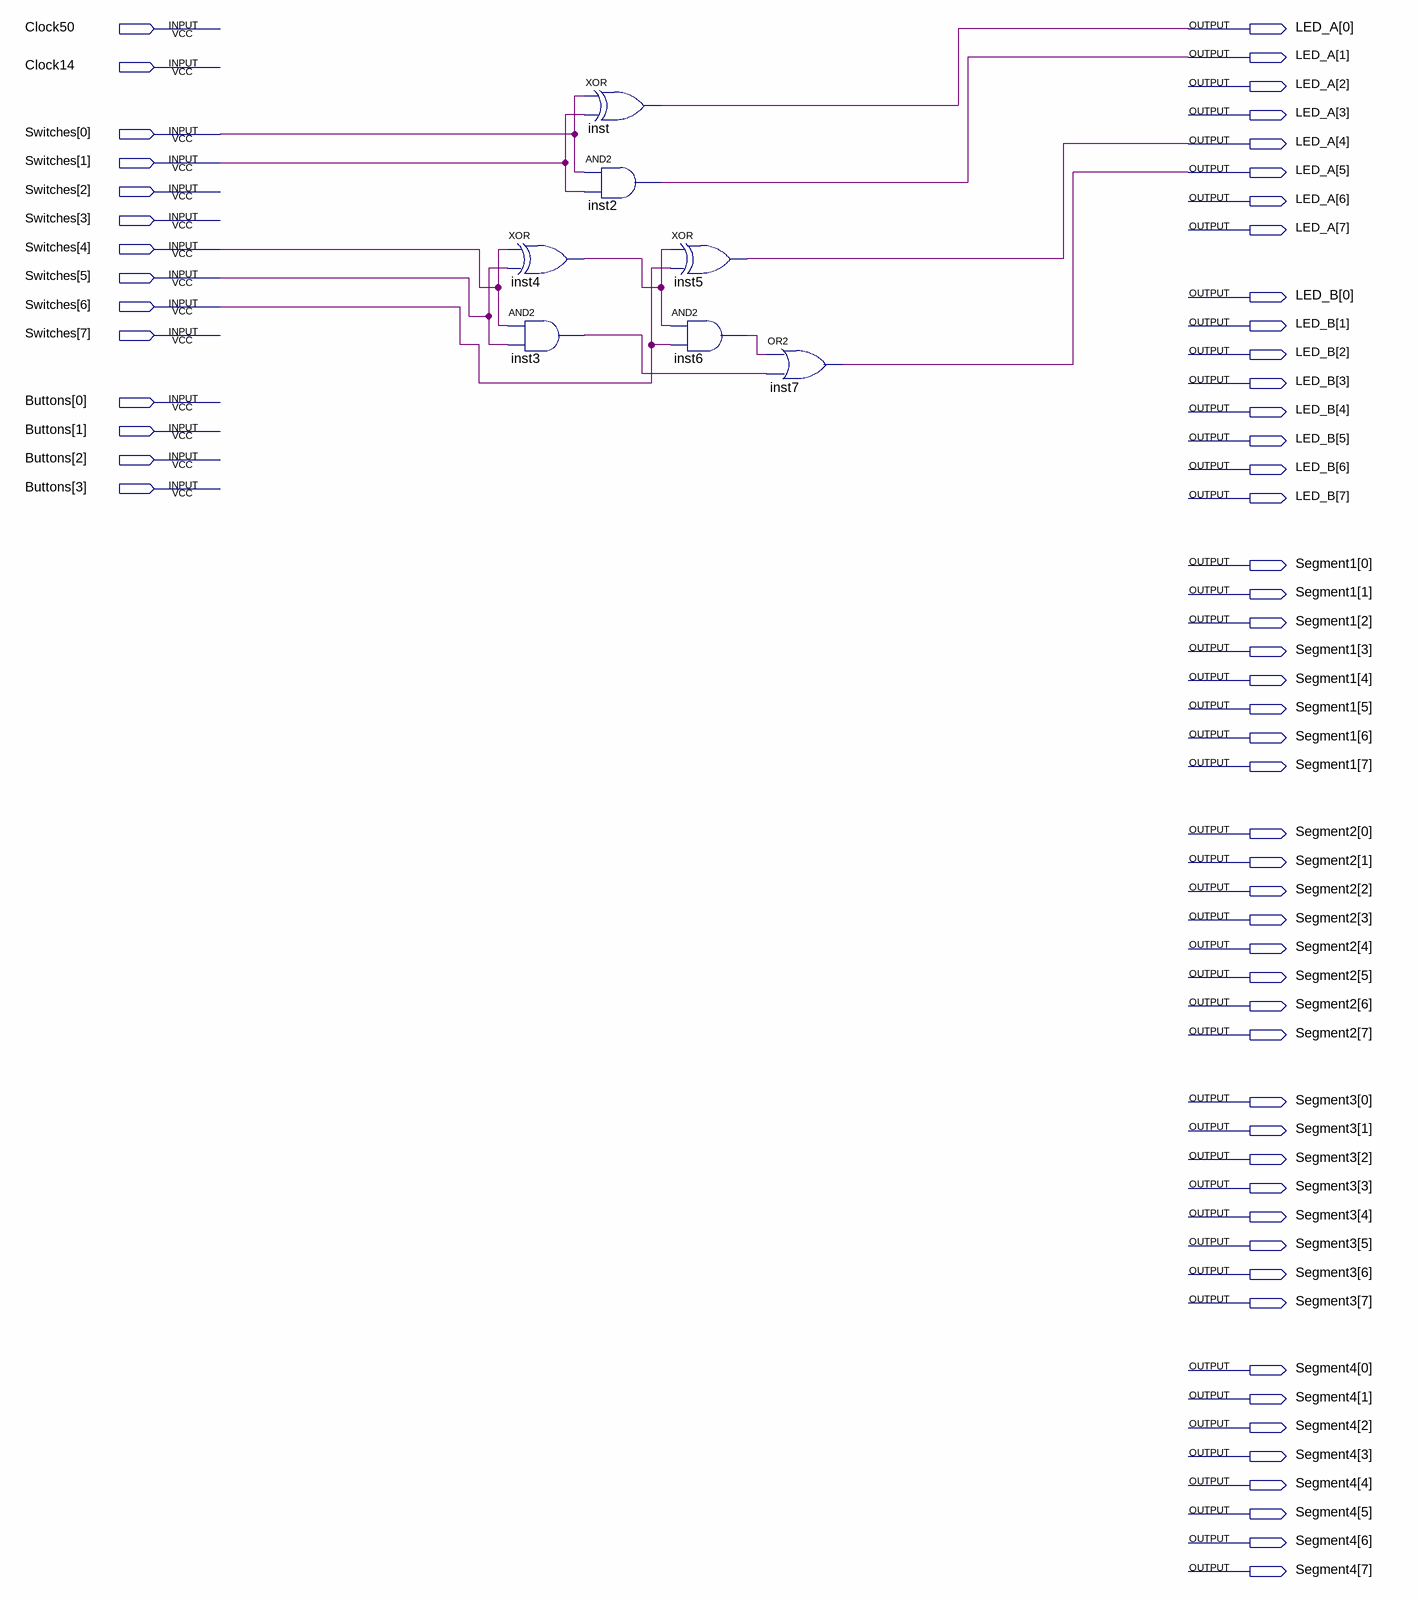
[diagram p0: schematic sheet]
// Quartus schematic Addierer.bdf as structural Verilog: 7 symbols, 62 pins
module Addierer (
  input  Clock50,
  input  Clock14,
  input  [7:0] Switches,
  input  [3:0] Buttons,
  output [7:0] LED_A,
  output [7:0] LED_B,
  output [7:0] Segment1,
  output [7:0] Segment2,
  output [7:0] Segment3,
  output [7:0] Segment4
);

  wire inst3_out, inst4_out, inst6_out;

  xor inst4 (inst4_out, Switches[4], Switches[5]);
  and inst3 (inst3_out, Switches[4], Switches[5]);
  xor inst (LED_A[0], Switches[0], Switches[1]);
  and inst2 (LED_A[1], Switches[0], Switches[1]);
  xor inst5 (LED_A[4], inst4_out, Switches[6]);
  and inst6 (inst6_out, inst4_out, Switches[6]);
  or inst7 (LED_A[5], inst6_out, inst3_out);
endmodule
